# Altium schematic sheet RGB_LED_BUCK_Converters.SchDoc: RGB_LED_BUCK_Converters
size A4; Date: Not used; ApprovedBy: Not used; CheckedBy: Not used; Author: Not used; CompanyName: STMicroelectronics; DrawnBy: Not used; Engineer: Not used; Organization: Not used; Address1: Not used; Address2: Not used; Address3: Not used; Address4: Not used; DocumentNumber: Not used; Revision: Not used; SheetNumber: 6; SheetTotal: 12; CurrentTime: Not used; CurrentDate: Not used; Time: Not used; DocumentFullPathAndName: Not used; DocumentName: Not used; ModifiedDate: Not used; ImagePath: Not used; ProjectName: Not used; Application_BuildNumber: Not used
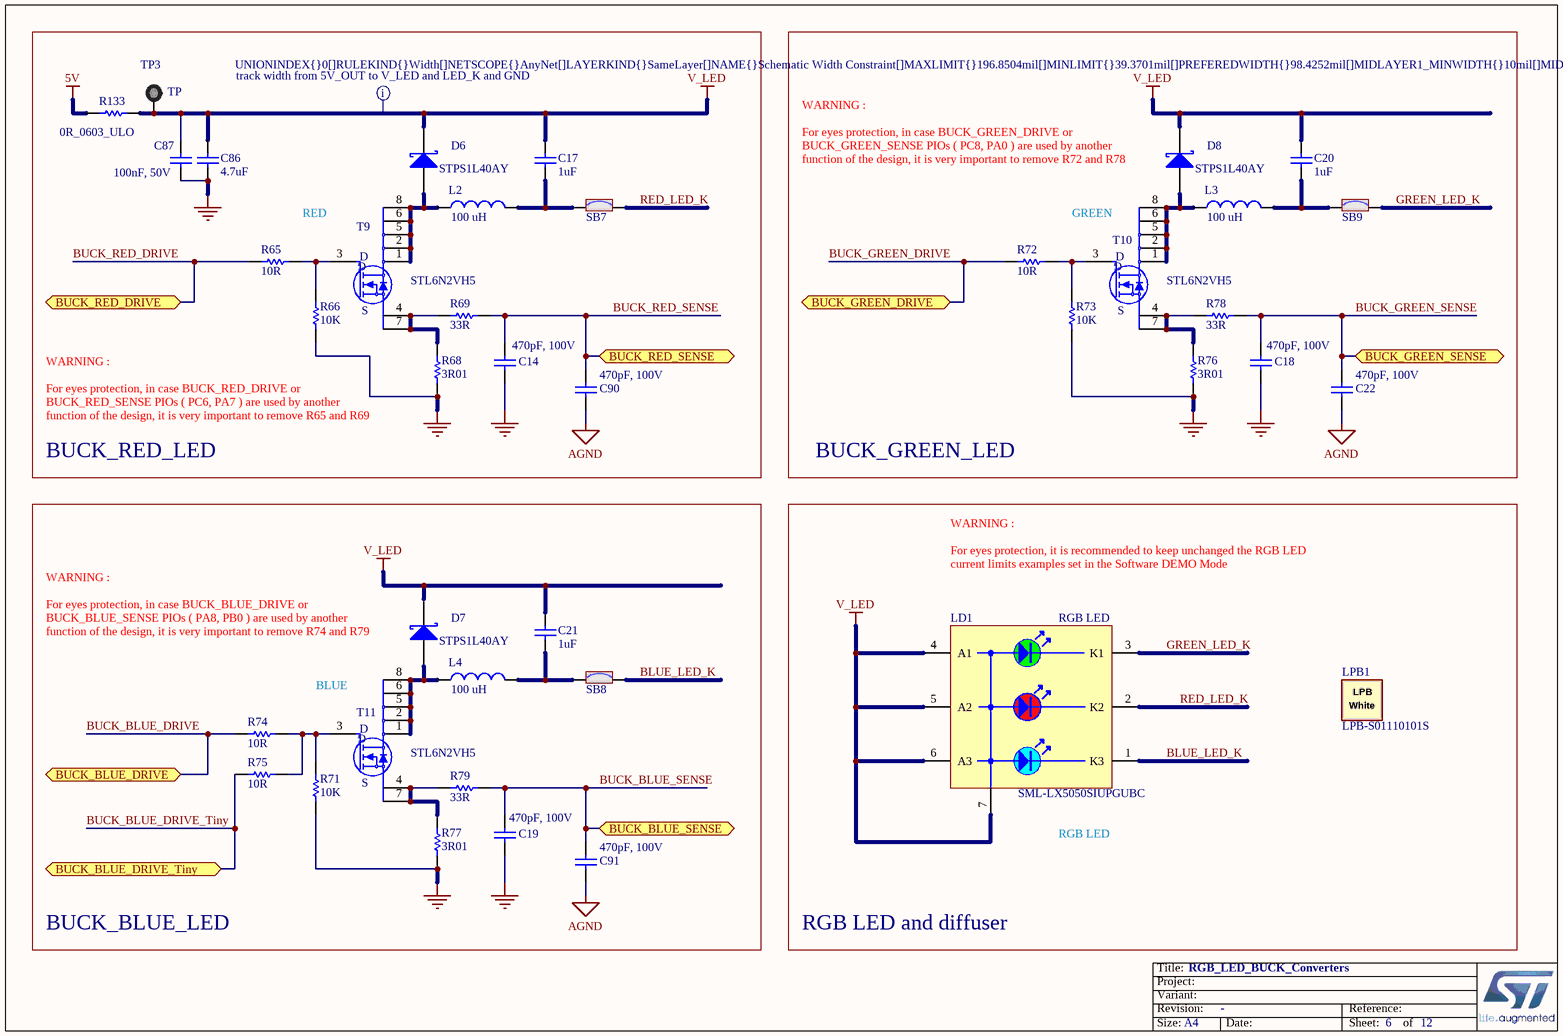
[diagram p0: RGB_LED_BUCK_Converters.SchDoc]

## Parts
C14  value 470pF, 100V  [C0603_H0P8]  (hidden comment: Capacitor)
C17  value 1uF  [C0805_H0P85]
C18  value 470pF, 100V  [C0603_H0P8]  (hidden comment: Capacitor)
C19  value 470pF, 100V  [C0603_H0P8]  (hidden comment: Capacitor)
C20  value 1uF  [C0805_H0P85]
C21  value 1uF  [C0805_H0P85]
C22  value 470pF, 100V  [C0603_H0P8]  (hidden comment: Capacitor)
C86  value 4.7uF  [C0603]
C87  value 100nF, 50V  [C0805_H0P85]
C90  value 470pF, 100V  [C0603_H0P8]  (hidden comment: Capacitor)
C91  value 470pF, 100V  [C0603_H0P8]  (hidden comment: Capacitor)
D6  value STPS1L40AY  [DIO_SMA_1A_2K]
D7  value STPS1L40AY  [DIO_SMA_1A_2K]
D8  value STPS1L40AY  [DIO_SMA_1A_2K]
L2  value 100 uH  [IND_SUNLORD_SWPA5040S]  (hidden comment: Inductor)
L3  value 100 uH  [IND_SUNLORD_SWPA5040S]  (hidden comment: Inductor)
L4  value 100 uH  [IND_SUNLORD_SWPA5040S]  (hidden comment: Inductor)
LD1  value RGB LED  Manufacturer_Part_Number: SML-LX5050SIUPGUBC  [LED_PLCC6-EPAD_LUMEX_SML-LX5050SIUPGUBC]
LPB1  LPB-S01110101S  [LIGHT_10MM-SQUARE-LIGHT-BAR_LUMEX_LPB-S01110101S]
R65  value 10R  [R0805_H0P5]
R66  value 10K  [R0805]
R68  value 3R01  [R1206_H0P55]
R69  value 33R  [R0603]
R71  value 10K  [R0805]
R72  value 10R  [R0805_H0P5]
R73  value 10K  [R0805]
R74  value 10R  [R0805_H0P5]
R75  value 10R  [R0805_H0P5]
R76  value 3R01  [R1206_H0P55]
R77  value 3R01  [R1206_H0P55]
R78  value 33R  [R0603]
R79  value 33R  [R0603]
R133  value 0R_0603_ULO  [R0603]
SB7  (no value)  [SOLDER-BRIDGE_R0603-0R]
SB8  (no value)  [SOLDER-BRIDGE_R0603-0R]
SB9  (no value)  [SOLDER-BRIDGE_R0603-0R]
T9  value STL6N2VH5  [MOS_POWERFLAT_2X2_P065]
T10  value STL6N2VH5  [MOS_POWERFLAT_2X2_P065]
T11  value STL6N2VH5  [MOS_POWERFLAT_2X2_P065]
TP3  value TP  [TP_PTH_1MM_2MM]

## Blocks framed on the sheet
BUCK_RED_LED: C14 C17 C86 C87 C90 D6 L2 R65 R66 R68 R69 R133 SB7 T9 TP3
BUCK_GREEN_LED: C18 C20 C22 D8 L3 R72 R73 R76 R78 SB9 T10
BUCK_BLUE_LED: C19 C21 C91 D7 L4 R71 R74 R75 R77 R79 SB8 T11
RGB LED and diffuser: LD1 LPB1

## Ports
BUCK_BLUE_DRIVE, BUCK_BLUE_DRIVE_Tiny, BUCK_BLUE_SENSE, BUCK_GREEN_DRIVE, BUCK_GREEN_SENSE, BUCK_RED_DRIVE, BUCK_RED_SENSE

## Nets
5V: R133.1
AGND: C22.1 C90.1 C91.1
GND: C14.1 C18.1 C19.1 C86.1 C87.1 R66.1 R68.1 R71.1 R73.1 R76.1 R77.1
V_LED: C17.2 C20.2 C21.2 C86.2 C87.2 D6.2(K) D7.2(K) D8.2(K) LD1.4(A1) LD1.5(A2) LD1.6(A3) LD1.7(SLUG) R133.2 TP3.1
BLUE_LED_K: LD1.1(K3) SB8.2
BUCK_BLUE_DRIVE: R74.1 ; port BUCK_BLUE_DRIVE
BUCK_BLUE_DRIVE_Tiny: R75.1 ; port BUCK_BLUE_DRIVE_Tiny
BUCK_BLUE_SENSE: C19.2 C91.2 R79.2 ; port BUCK_BLUE_SENSE
BUCK_GREEN_DRIVE: R72.1 ; port BUCK_GREEN_DRIVE
BUCK_GREEN_SENSE: C18.2 C22.2 R78.2 ; port BUCK_GREEN_SENSE
BUCK_RED_DRIVE: R65.1 ; port BUCK_RED_DRIVE
BUCK_RED_SENSE: C14.2 C90.2 R69.2 ; port BUCK_RED_SENSE
GREEN_LED_K: LD1.3(K1) SB9.2
RED_LED_K: LD1.2(K2) SB7.2
NetC17_1: C17.1 L2.2 SB7.1
NetC20_1: C20.1 L3.2 SB9.1
NetC21_1: C21.1 L4.2 SB8.1
NetD6_1: D6.1(A) L2.1 T9.1(D) T9.2(D) T9.5(D) T9.6(D) T9.8(D)
NetD7_1: D7.1(A) L4.1 T11.1(D) T11.2(D) T11.5(D) T11.6(D) T11.8(D)
NetD8_1: D8.1(A) L3.1 T10.1(D) T10.2(D) T10.5(D) T10.6(D) T10.8(D)
NetR65_2: R65.2 R66.2 T9.3(G)
NetR68_2: R68.2 R69.1 T9.4(S) T9.7(S)
NetR71_2: R71.2 R74.2 R75.2 T11.3(G)
NetR72_2: R72.2 R73.2 T10.3(G)
NetR76_2: R76.2 R78.1 T10.4(S) T10.7(S)
NetR77_2: R77.2 R79.1 T11.4(S) T11.7(S)

## Layout directives
rule Width Constraint [Pref Width = 2.5mm    Min Width = 1mm    Max Width = 5mm]: V_LED

## Notes on the sheet
- WARNING :
- For eyes protection, in case BUCK_GREEN_DRIVE or
- (near D8) function of the design, it is very important to remove R72 and R78
- BUCK_GREEN_SENSE PIOs ( PC8, PA0 ) are used by another
- RED
- (near T10) GREEN
- For eyes protection, in case BUCK_RED_DRIVE or
- BUCK_RED_SENSE PIOs ( PC6, PA7 ) are used by another
- (near R68) function of the design, it is very important to remove R65 and R69
- For eyes protection, it is recommended to keep unchanged the RGB LED
- current limits examples set in the Software DEMO Mode
- For eyes protection, in case BUCK_BLUE_DRIVE or
- (near D7) function of the design, it is very important to remove R74 and R79
- BUCK_BLUE_SENSE PIOs ( PA8, PB0 ) are used by another
- (near T11) BLUE
- (near LD1) RGB LED
- Title:
- Project:
- Size:
- Revision:
- Variant:
- A4
- -
- Date:
- Reference:
- Sheet:
- of
- (in symbol MCD-01191) LPB; White

## Library data of the parts
C14 C18 C19 C22 C90 C91 = MCD-01731: Capacitor, MLCC, 470pF, 100V, X7R, 10%, 0603, T=0.8mm; Manufacturer_Part_Number: CC0603KRX7R0BB471; Manufacturer: YAGEO; Provided_By: SUBCO; Internal_Part_Number: MCD-01731; Status: Footprint available; Part_Type: Capacitor; Package: C0603; ComponentLink1Description: Datasheet; ComponentLink1URL: http://tunmcdsvn.tun.st.com/Component_Datasheet_Library/Trunk/Capacitors/Yageo_Multilayer_Capacitor_NPO_X7R_100V_to_630V_0.47pF%20to%202.2uF/Yageo_Multilayer_Capacitor_NPO_X7R_V21_100V_to_630V_0.47pF_to_2.2uF.pdf
C17 C20 C21 = MCD-01550: Capacitor, MLCC, 1uF, 16V, X5R, 10%, 0805, T=0.85mm; Manufacturer_Part_Number: CC0805KRX5R7BB105; Manufacturer: YAGEO; Provided_By: SUBCO; Internal_Part_Number: MCD-01550; Status: Footprint available; Part_Type: Capacitor; Package: C0805; ComponentLink1Description: Datasheet; ComponentLink1URL: http://tunmcdsvn.tun.st.com/Component_Datasheet_Library/Trunk/Capacitors/Yageo_Multilayer_Capacitor_X7R_series_100pF_to_22uF/YAGEO_MLCC_UPY-GPHC_X7R_6.3V-to-50V_18.pdf
C86 = MCD-00009: Capacitor, MLCC, 4.7uF, 16V, X5R, 10%, 0603, T=0.8mm; Manufacturer_Part_Number: CC0603KRX5R7BB475; Manufacturer: YAGEO; Provided_By: SUBCO; Internal_Part_Number: MCD-00009; Status: Released; Part_Type: Capacitor; Package: C0603; ComponentLink1Description: Datasheet; ComponentLink1URL: http://tunmcdsvn.tun.st.com/Component_Datasheet_Library/Trunk/Capacitors/Yageo_Multilayer_capacitor_X5R_series_100pF_to_100uF
C87 = MCD-01525: Capacitor, MLCC, 100nF, 50V, X7R, 10%, 0805, T=0,85mm; Manufacturer_Part_Number: CC0805KRX7R9BB104; Manufacturer: YAGEO; Provided_By: SUBCO; Internal_Part_Number: MCD-01525; Status: Footprint available; Part_Type: Capacitor; Package: C0805; ComponentLink1Description: Datasheet; ComponentLink1URL: http://tunmcdsvn.tun.st.com/Component_Datasheet_Library/Trunk/Capacitors/Yageo_Multilayer_Capacitor_X7R_series_100pF_to_22uF/Yageo_Mutilayer_Capacitor_X7R_100pF_to_22uF.pdf
D6-D8 = MCD-00606: Low Drop power Schottky rectifier(1A, 40V, 0.37 V); Part_Type: Diode; Manufacturer: STMICROELECTRONICS; BMS_Part_Number: 9151017; Provided_By: SUBCO with ST control; Internal_Part_Number: MCD-00606; Status: Checked; Manufacturer_Part_Number: STPS1L40AY; Package: SMA; ComponentLink1Description: Datasheet; ComponentLink1URL: http://tunmcdsvn.tun.st.com/Component_Datasheet_Library/Trunk/Diodes/STM_SCHOTTKY_STPS1L40AY
L2-L4 = MCD-01734: SMD Wire wound power inductor, 100uH, 20%, Isat 0.9A, 560mohm, 5.0x5.0x4.0mm; Manufacturer_Part_Number: SWPA5040S101MT; Manufacturer: SUNLORD; Provided_By: SUBCO; Internal_Part_Number: MCD-01734; Status: Footprint available; Part_Type: Inductor; ComponentLink1Description: Datasheet; ComponentLink1URL: http://tunmcdsvn.tun.st.com/Component_Datasheet_Library/Trunk/Inductors/SUNLORD_Power_Inductor_SWPA5040S-Series/SUNLORD_Power_Inductor_SWPA5040S-Series.pdf
LD1 = MCD-01580: Mid Power RGB LED , SMD, 3x150 mA; Part_Type: Display; Manufacturer: LUMEX; Provided_By: SUBCO; Internal_Part_Number: MCD-01580; Status: Footprint available; ComponentLink1Description: Datasheet; ComponentLink1URL: http://tunmcdsvn.tun.st.com/Component_Datasheet_Library/Trunk/Display/LUMEX_LED_RGB_SML-LX5050SIUPGUBC/LUMEX_LED_SML-LX5050SIUPGUBC.pdf
LPB1 = MCD-01191: 10mm Square Light Bar.; Part_Type: Misc; Manufacturer: LUMEX; Alternate_Manufacturer_Part_Number: LPB-S01110101S-110945; Provided_By: SUBCO; Internal_Part_Number: MCD-01191; Status: Footprint available; Manufacturer_Part_Number: LPB-S01110101S; Alternate_Manufacturer: LUMEX; ComponentLink1Description: Datasheet; ComponentLink1URL: http://tunmcdsvn.tun.st.com/Component_Datasheet_Library/Trunk/Misc/LUMEX_LPB-S01110101S
R65 R72 R74 R75 = MCD-01548: Resistor,10R,0805,1%, 1/8W; Manufacturer_Part_Number: RC0805FR-0710RL; Manufacturer: YAGEO; Provided_By: SUBCO; Internal_Part_Number: MCD-01548; Status: Footprint available; Part_Type: Resistor; Package: R0805; ComponentLink1Description: Datasheet; ComponentLink1URL: http://tunmcdsvn.tun.st.com/Component_Datasheet_Library/Trunk/Resistors/Yageo_Resistor_RC0805-series/Yageo_Resistor_RC0805-series.pdf
R66 R71 R73 = MCD-01154: Resistor,10K,0805,1%,1/8W; Manufacturer_Part_Number: RC0805FR-0710KL; Manufacturer: YAGEO; Provided_By: SUBCO; Internal_Part_Number: MCD-01154; Status: Released; Part_Type: Resistor; Package: R0805; ComponentLink1Description: Datasheet; ComponentLink1URL: http://tunmcdsvn.tun.st.com/Component_Datasheet_Library/Trunk/Resistors/Yageo_Resistor_RC0805-series
R68 R76 R77 = MCD-01528: Resistor, 3R01, 1206, 1%, 1/4W; Manufacturer_Part_Number: RC1206FR-073R01L; Manufacturer: YAGEO; Provided_By: SUBCO; Internal_Part_Number: MCD-01528; Status: Footprint available; Part_Type: Resistor; Package: R1206; ComponentLink1Description: Datasheet; ComponentLink1URL: http://tunmcdsvn.tun.st.com/Component_Datasheet_Library/Trunk/Resistors/Yageo_Resistor_RC1206-series/Yageo_Resistor_RC1206-series.pdf
R69 R78 R79 = MCD-00456: Resistor,33R,0603,1%,1/10W; Manufacturer_Part_Number: RC0603FR-0733RL; Manufacturer: YAGEO; BMS_Part_Number: 9129732; Provided_By: SUBCO; Internal_Part_Number: MCD-00456; Status: Released; Part_Type: Resistor; Package: R0603; ComponentLink1Description: Datasheet; ComponentLink1URL: http://tunmcdsvn.tun.st.com/Component_Datasheet_Library/Trunk/Resistors/Yageo_Resistor_RC0603-series
R133 = MCD-00181: Resistor,0R,0603,ULO; Manufacturer_Part_Number: PMR03EZPJ000; Manufacturer: ROHM; Provided_By: SUBCO; Internal_Part_Number: MCD-00181; Status: Released; Part_Type: Resistor; Package: R0603; ComponentLink1Description: Datasheet; ComponentLink1URL: http://tunmcdsvn.tun.st.com/Component_Datasheet_Library/Trunk/Resistors/ROHM_ULtra_low_Ohmic_Resistor_PMR10EZPJ000
SB7-SB9 = MCD-00071: Solder Bridge ON; Part_Type: Mechanical; Manufacturer_Part_Number: RC0603JR-070RL; Manufacturer: YAGEO; Provided_By: SUBCO; Internal_Part_Number: MCD-00071; Status: Released; Package: SB0603; ComponentLink1Description: Datasheet; ComponentLink1URL: http://tunmcdsvn.tun.st.com/Component_Datasheet_Library/Trunk/Resistors/Yageo_Resistor_RC0603-series
T9-T11 = MCD-01028: N-channel 20 V, 0.025 O typ., 6 A STripFET™ V Power MOSFET in a PowerFLAT™ 2x2 package; Part_Type: IC; Manufacturer: STMICROELECTRONICS; BMS_Part_Number: 9153558; Provided_By: SUBCO with ST control; Internal_Part_Number: MCD-01028; Status: Checked; Manufacturer_Part_Number: STL6N2VH5; Package: PowerFLAT 2x2; ComponentLink1Description: Datasheet; ComponentLink1URL: http://tunmcdsvn.tun.st.com/Component_Datasheet_Library/Trunk/IC/STM_POWER_MOSFET_N_STL6N2VH5
TP3 = MCD-01506: Test Point trought hole 1mm/2mm; Part_Type: Mechanical; Internal_Part_Number: MCD-01506; Status: Released; Manufacturer_Part_Number: n/a; Manufacturer: n/a; ComponentLink1Description: Datasheet; ComponentLink1URL: n/a; Provided_By: n/a